# Altium project 9-Safety-Relay-Board.PrjPcb
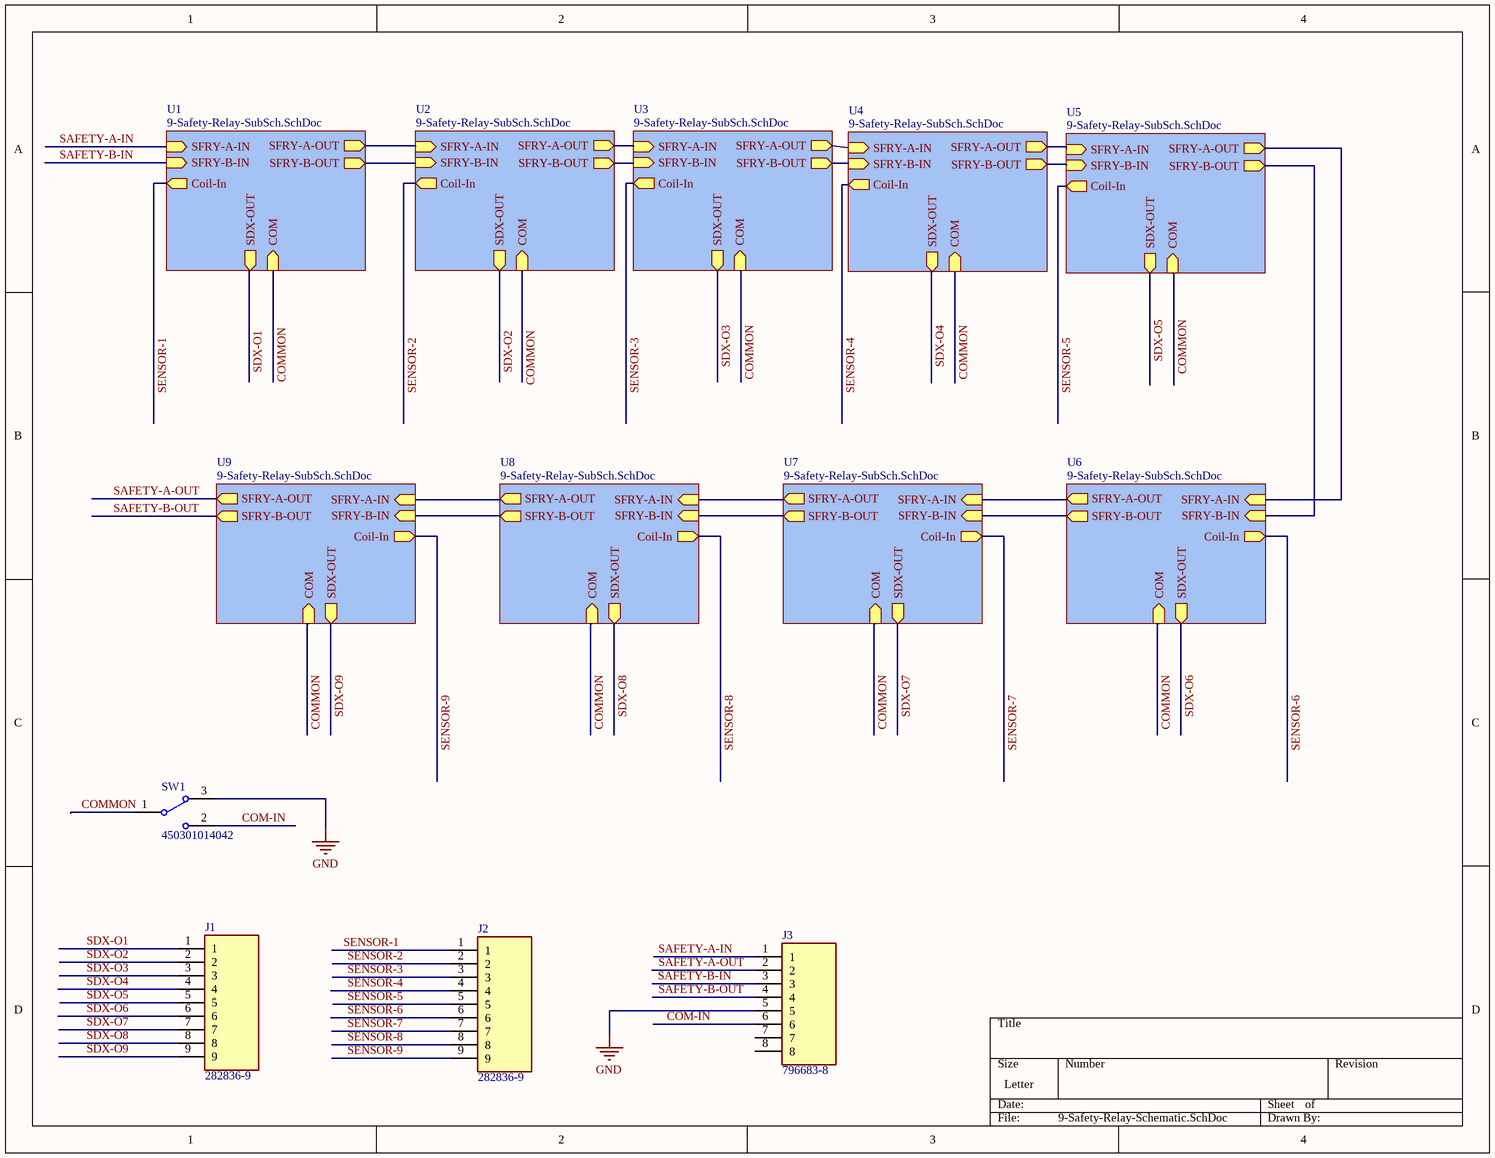
[diagram p0: 9-Safety-Relay-Schematic.SchDoc]
1 sheet, 4 parts. Net scope: hierarchical (ports join the sheet entries above them; power ports are global).
Board file: 9-Safety-Relay-PCB.PcbDoc

## Sheet 9-Safety-Relay-Schematic.SchDoc
size Letter

### Parts
J1  282836-9  [SHDR9W130P0X500_1X9_4500X820X1020P]
J2  282836-9  [SHDR9W130P0X500_1X9_4500X820X1020P]
J3  796683-8  [SHDR8W110P0X500_1X8_4000X900X1520P]
SW1  450301014042  [450301014042]

### Sub-sheets
U1 = 9-Safety-Relay-SubSch.SchDoc (file not in this document): SFRY-A-IN (in), SFRY-B-IN (in), Coil-In (out), SFRY-A-OUT (out), SFRY-B-OUT (out), SDX-OUT (out), COM (in)
U2 = 9-Safety-Relay-SubSch.SchDoc (file not in this document): SFRY-A-IN (in), SFRY-B-IN (in), Coil-In (out), SFRY-A-OUT (out), SFRY-B-OUT (out), SDX-OUT (out), COM (in)
U3 = 9-Safety-Relay-SubSch.SchDoc (file not in this document): SFRY-A-IN (in), SFRY-B-IN (in), Coil-In (out), SFRY-A-OUT (out), SFRY-B-OUT (out), SDX-OUT (out), COM (in)
U4 = 9-Safety-Relay-SubSch.SchDoc (file not in this document): SFRY-A-IN (in), SFRY-B-IN (in), Coil-In (out), SFRY-A-OUT (out), SFRY-B-OUT (out), SDX-OUT (out), COM (in)
U5 = 9-Safety-Relay-SubSch.SchDoc (file not in this document): SFRY-A-IN (in), SFRY-B-IN (in), Coil-In (out), SFRY-A-OUT (out), SFRY-B-OUT (out), SDX-OUT (out), COM (in)
U6 = 9-Safety-Relay-SubSch.SchDoc (file not in this document): SFRY-A-IN (in), SFRY-B-IN (in), Coil-In (out), SFRY-A-OUT (out), SFRY-B-OUT (out), SDX-OUT (out), COM (in)
U7 = 9-Safety-Relay-SubSch.SchDoc (file not in this document): SFRY-A-IN (in), SFRY-B-IN (in), Coil-In (out), SFRY-A-OUT (out), SFRY-B-OUT (out), SDX-OUT (out), COM (in)
U8 = 9-Safety-Relay-SubSch.SchDoc (file not in this document): SFRY-A-IN (in), SFRY-B-IN (in), Coil-In (out), SFRY-A-OUT (out), SFRY-B-OUT (out), SDX-OUT (out), COM (in)
U9 = 9-Safety-Relay-SubSch.SchDoc (file not in this document): SFRY-A-IN (in), SFRY-B-IN (in), Coil-In (out), SFRY-A-OUT (out), SFRY-B-OUT (out), SDX-OUT (out), COM (in)

### Nets
GND: J3.5 SW1.3
COM-IN: J3.6 SW1.2
COMMON: SW1.1 ; sheet U1/COM, sheet U2/COM, sheet U3/COM, sheet U4/COM, sheet U5/COM, sheet U6/COM, sheet U7/COM, sheet U8/COM, sheet U9/COM
SAFETY-A-IN: J3.1 ; sheet U1/SFRY-A-IN
SAFETY-A-OUT: J3.2 ; sheet U9/SFRY-A-OUT
SAFETY-B-IN: J3.3 ; sheet U1/SFRY-B-IN
SAFETY-B-OUT: J3.4 ; sheet U9/SFRY-B-OUT
SDX-O1: J1.1 ; sheet U1/SDX-OUT
SDX-O2: J1.2 ; sheet U2/SDX-OUT
SDX-O3: J1.3 ; sheet U3/SDX-OUT
SDX-O4: J1.4 ; sheet U4/SDX-OUT
SDX-O5: J1.5 ; sheet U5/SDX-OUT
SDX-O6: J1.6 ; sheet U6/SDX-OUT
SDX-O7: J1.7 ; sheet U7/SDX-OUT
SDX-O8: J1.8 ; sheet U8/SDX-OUT
SDX-O9: J1.9 ; sheet U9/SDX-OUT
SENSOR-1: J2.1 ; sheet U1/Coil-In
SENSOR-2: J2.2 ; sheet U2/Coil-In
SENSOR-3: J2.3 ; sheet U3/Coil-In
SENSOR-4: J2.4 ; sheet U4/Coil-In
SENSOR-5: J2.5 ; sheet U5/Coil-In
SENSOR-6: J2.6 ; sheet U6/Coil-In
SENSOR-7: J2.7 ; sheet U7/Coil-In
SENSOR-8: J2.8 ; sheet U8/Coil-In
SENSOR-9: J2.9 ; sheet U9/Coil-In
(unnamed): sheet U1/SFRY-A-OUT, sheet U2/SFRY-A-IN
(unnamed): sheet U1/SFRY-B-OUT, sheet U2/SFRY-B-IN
(unnamed): sheet U2/SFRY-A-OUT, sheet U3/SFRY-A-IN
(unnamed): sheet U2/SFRY-B-OUT, sheet U3/SFRY-B-IN
(unnamed): sheet U3/SFRY-A-OUT, sheet U4/SFRY-A-IN
(unnamed): sheet U3/SFRY-B-OUT, sheet U4/SFRY-B-IN
(unnamed): sheet U4/SFRY-A-OUT, sheet U5/SFRY-A-IN
(unnamed): sheet U4/SFRY-B-OUT, sheet U5/SFRY-B-IN
(unnamed): sheet U5/SFRY-A-OUT, sheet U6/SFRY-A-IN
(unnamed): sheet U5/SFRY-B-OUT, sheet U6/SFRY-B-IN
(unnamed): sheet U6/SFRY-A-OUT, sheet U7/SFRY-A-IN
(unnamed): sheet U6/SFRY-B-OUT, sheet U7/SFRY-B-IN
(unnamed): sheet U7/SFRY-A-OUT, sheet U8/SFRY-A-IN
(unnamed): sheet U7/SFRY-B-OUT, sheet U8/SFRY-B-IN
(unnamed): sheet U8/SFRY-A-OUT, sheet U9/SFRY-A-IN
(unnamed): sheet U8/SFRY-B-OUT, sheet U9/SFRY-B-IN

Not connected (* = marked no-connect by the designer): J3 7 8

### Library data of the parts
J1 J2 = 282836-9: Connector; Manufacturer_Name: TE Connectivity; Allied_Number: 70285523; Datasheet Link: http://www.te.com/commerce/DocumentDelivery/DDEController?Action=srchrtrv&DocNm=282836&DocType=Customer+Drawing&DocLang=English; Height: 10.2mm; Manufacturer_Part_Number: 282836-9; Mouser Part Number: 571-282836-9; Mouser Price/Stock: https://www.mouser.com/Search/Refine.aspx?Keyword=571-282836-9; RS Part Number: 3617746; RS Price/Stock: http://uk.rs-online.com/web/p/products/3617746; Allied Price/Stock: https://www.alliedelec.com/te-connectivity-282836-9/70285523/
J3 = 796683-8: Connector; Manufacturer_Name: TE Connectivity; Datasheet Link: http://www.te.com/commerce/DocumentDelivery/DDEController?Action=srchrtrv&DocNm=796683&DocType=Customer+Drawing&DocLang=English; Height: 15.2mm; Manufacturer_Part_Number: 796683-8; Mouser Part Number: 571-796683-8; Mouser Price/Stock: https://www.mouser.com/Search/Refine.aspx?Keyword=571-796683-8
SW1 = CMP-1466-00001-1: WS-SLTV 10mm*2.5mm, SPDT, ON-ON, 2.54mm, straight type, THT, Mini Slide Switch, 3 pins; Manufacturer: Wuerth Elektronik; NoPins: 06; ComponentLink2URL: http://katalog.we-online.de/em/datasheet/450301014042.pdf; PartNumber: 450301014042; ComponentLink1Description: Manufacturer URL; ComponentLink2Description: Datasheet; PackageReference: 450301014042; ComponentLink1URL: http://www.we-online.com